# Altium schematic sheet PATHOS_SOM_Power.SchDoc: SOM Power Supply
size A4; Author: A. Kalberer; CompanyName: NTB; Organization: NTB Interstate University of Applied; Address1: Werdenbergstrasse 4; Address3: 9471 Buchs; Address4: Switzerland; Revision: 0.1; Organization1: Sciences of Technology Buchs; Size: A4
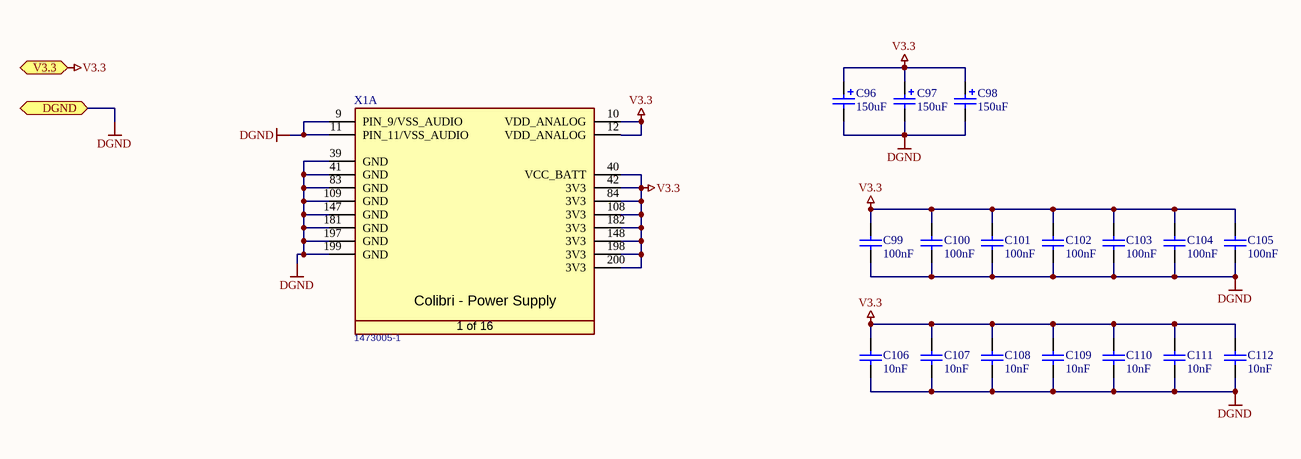
[diagram p0: PATHOS_SOM_Power.SchDoc]

## Parts
C96  150uF  [ChipC_7343-40]
C97  150uF  [ChipC_7343-40]
C98  150uF  [ChipC_7343-40]
C99  100nF  [0603_3D]
C100  100nF  [0603_3D]
C101  100nF  [0603_3D]
C102  100nF  [0603_3D]
C103  100nF  [0603_3D]
C104  100nF  [0603_3D]
C105  100nF  [0603_3D]
C106  10nF  [0603_3D]
C107  10nF  [0603_3D]
C108  10nF  [0603_3D]
C109  10nF  [0603_3D]
C110  10nF  [0603_3D]
C111  10nF  [0603_3D]
C112  10nF  [0603_3D]
X1  Manufacturer Part No.: 1473005-1  [T_Tyco_1473005-1]  (hidden comment: CON-Tyco-1473005-1-200-0.6mm)  (part A of 16)

## Ports
DGND, V3.3

## Nets
DGND: C96.2(Neg) C97.2(Neg) C98.2(Neg) C99.1 C100.1 C101.1 C102.1 C103.1 C104.1 C105.1 C106.1 C107.1 C108.1 C109.1 C110.1 C111.1 C112.1 X1.9(PIN_9/VSS_AUDIO) X1.11(PIN_11/VSS_AUDIO) X1.39(GND) X1.41(GND) X1.83(GND) X1.109(GND) X1.147(GND) X1.181(GND) X1.197(GND) X1.199(GND) ; port DGND
V3.3: C96.1(Pos) C97.1(Pos) C98.1(Pos) C99.2 C100.2 C101.2 C102.2 C103.2 C104.2 C105.2 C106.2 C107.2 C108.2 C109.2 C110.2 C111.2 C112.2 X1.10(VDD_ANALOG) X1.12(VDD_ANALOG) X1.40(VCC_BATT) X1.42(3V3) X1.84(3V3) X1.108(3V3) X1.148(3V3) X1.182(3V3) X1.198(3V3) X1.200(3V3) ; port V3.3

## Notes on the sheet
- Title:
- Description:
- Size:
- Date:
- Name:
- Number:
- Time:
- Revision:
- Sheet
- Checked:
- of
- File:
- (in symbol CON-Tyco-1473005-1-200-0.6mm, part A) Colibri - Power Supply; 1 of 16

## Library data of the parts
C96-C98 = C_POL: Polarized Capacitor Positive Mark Bar; #Manufacturer: Generic Components; #Publisher: Dr. A. Heinzelmann; #Class: Passive; Initial Voltage: 0V; Type: Tantal; #Published: 2006-10-07; #ClassSub: Capacitor; Voltage Maxium: *; Value: 150uF
C99-C112 = C: Capacitor; #Manufacturer: Generic Components; #Publisher: Dr. A. Heinzelmann; #Class: Passive; Initial Voltage: 0V; #Published: 2006-10-07; #ClassSub: Capacitor; Type: *; Voltage Maximum: *
  C99-C105: Value: 100nF
  C106-C112: Value: 10nF
X1 = CON-Tyco-1473005-1-200-0.6mm: SODIMM Connector; Manufacturer Name: Tyco; No. of ways: 200